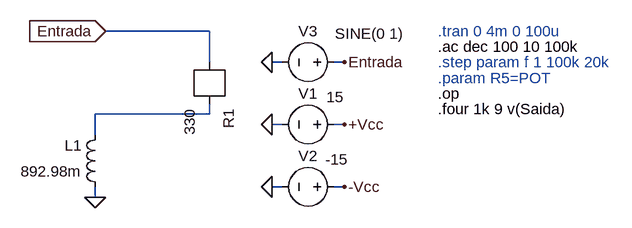
[diagram p0: schematic lab_Max_2.asc]
lab_Max_2.asc, the LTspice schematic file:
Version 4
SHEET 1 1388 696
WIRE 576 96 416 96
WIRE 576 144 576 96
WIRE 688 144 672 144
WIRE 784 144 768 144
WIRE 576 224 576 208
WIRE 576 224 400 224
WIRE 688 240 672 240
WIRE 784 240 768 240
WIRE 400 256 400 224
WIRE 688 336 672 336
WIRE 784 336 768 336
WIRE 400 352 400 336
FLAG 784 240 +Vcc
FLAG 784 336 -Vcc
FLAG 672 336 0
FLAG 672 240 0
FLAG 416 96 Entrada
IOPIN 416 96 In
FLAG 672 144 0
FLAG 784 144 Entrada
FLAG 400 352 0
SYMBOL voltage 784 240 R90
WINDOW 0 -32 56 VBottom 2
WINDOW 3 -58 14 VTop 2
SYMATTR InstName V1
SYMATTR Value 15
SYMBOL voltage 784 336 R90
WINDOW 0 -32 56 VBottom 2
WINDOW 3 -58 12 VTop 2
SYMATTR InstName V2
SYMATTR Value -15
SYMBOL voltage 784 144 R90
WINDOW 0 -32 56 VBottom 2
WINDOW 3 -60 -38 VTop 2
SYMATTR InstName V3
SYMATTR Value SINE(0 1)
SYMATTR Value2 AC 1
SYMBOL r 576 144 R90
SYMATTR InstName R1
SYMATTR Value 330
SYMBOL ind 416 352 R180
WINDOW 0 36 80 Left 2
WINDOW 3 36 40 Left 2
SYMATTR InstName L1
SYMATTR Value 892.98m
TEXT 928 120 Left 2 !.ac dec 100 10 100k
TEXT 928 216 Left 2 !.four 1k 9 v(Saida)
TEXT 928 96 Left 2 ;.tran 0 4m 0 100u
TEXT 928 144 Left 2 ;.step param f 1 100k 20k
TEXT 928 168 Left 2 ;.param R5=POT
TEXT 928 192 Left 2 !.op

The netlist it stands for:
* lab_Max_2.asc
V1 +Vcc 0 15
V2 -Vcc 0 -15
V3 Entrada 0 SINE(0 1) AC 1
R1 N001 Entrada 330
L1 0 N001 892.98m
.ac dec 100 10 100k
.four 1k 9 v(Saida)
* .tran 0 4m 0 100u
* .step param f 1 100k 20k
* .param R5=POT
.op
.backanno
.end